# EAGLE design Automaton_no_switches (EAGLE 6.1)
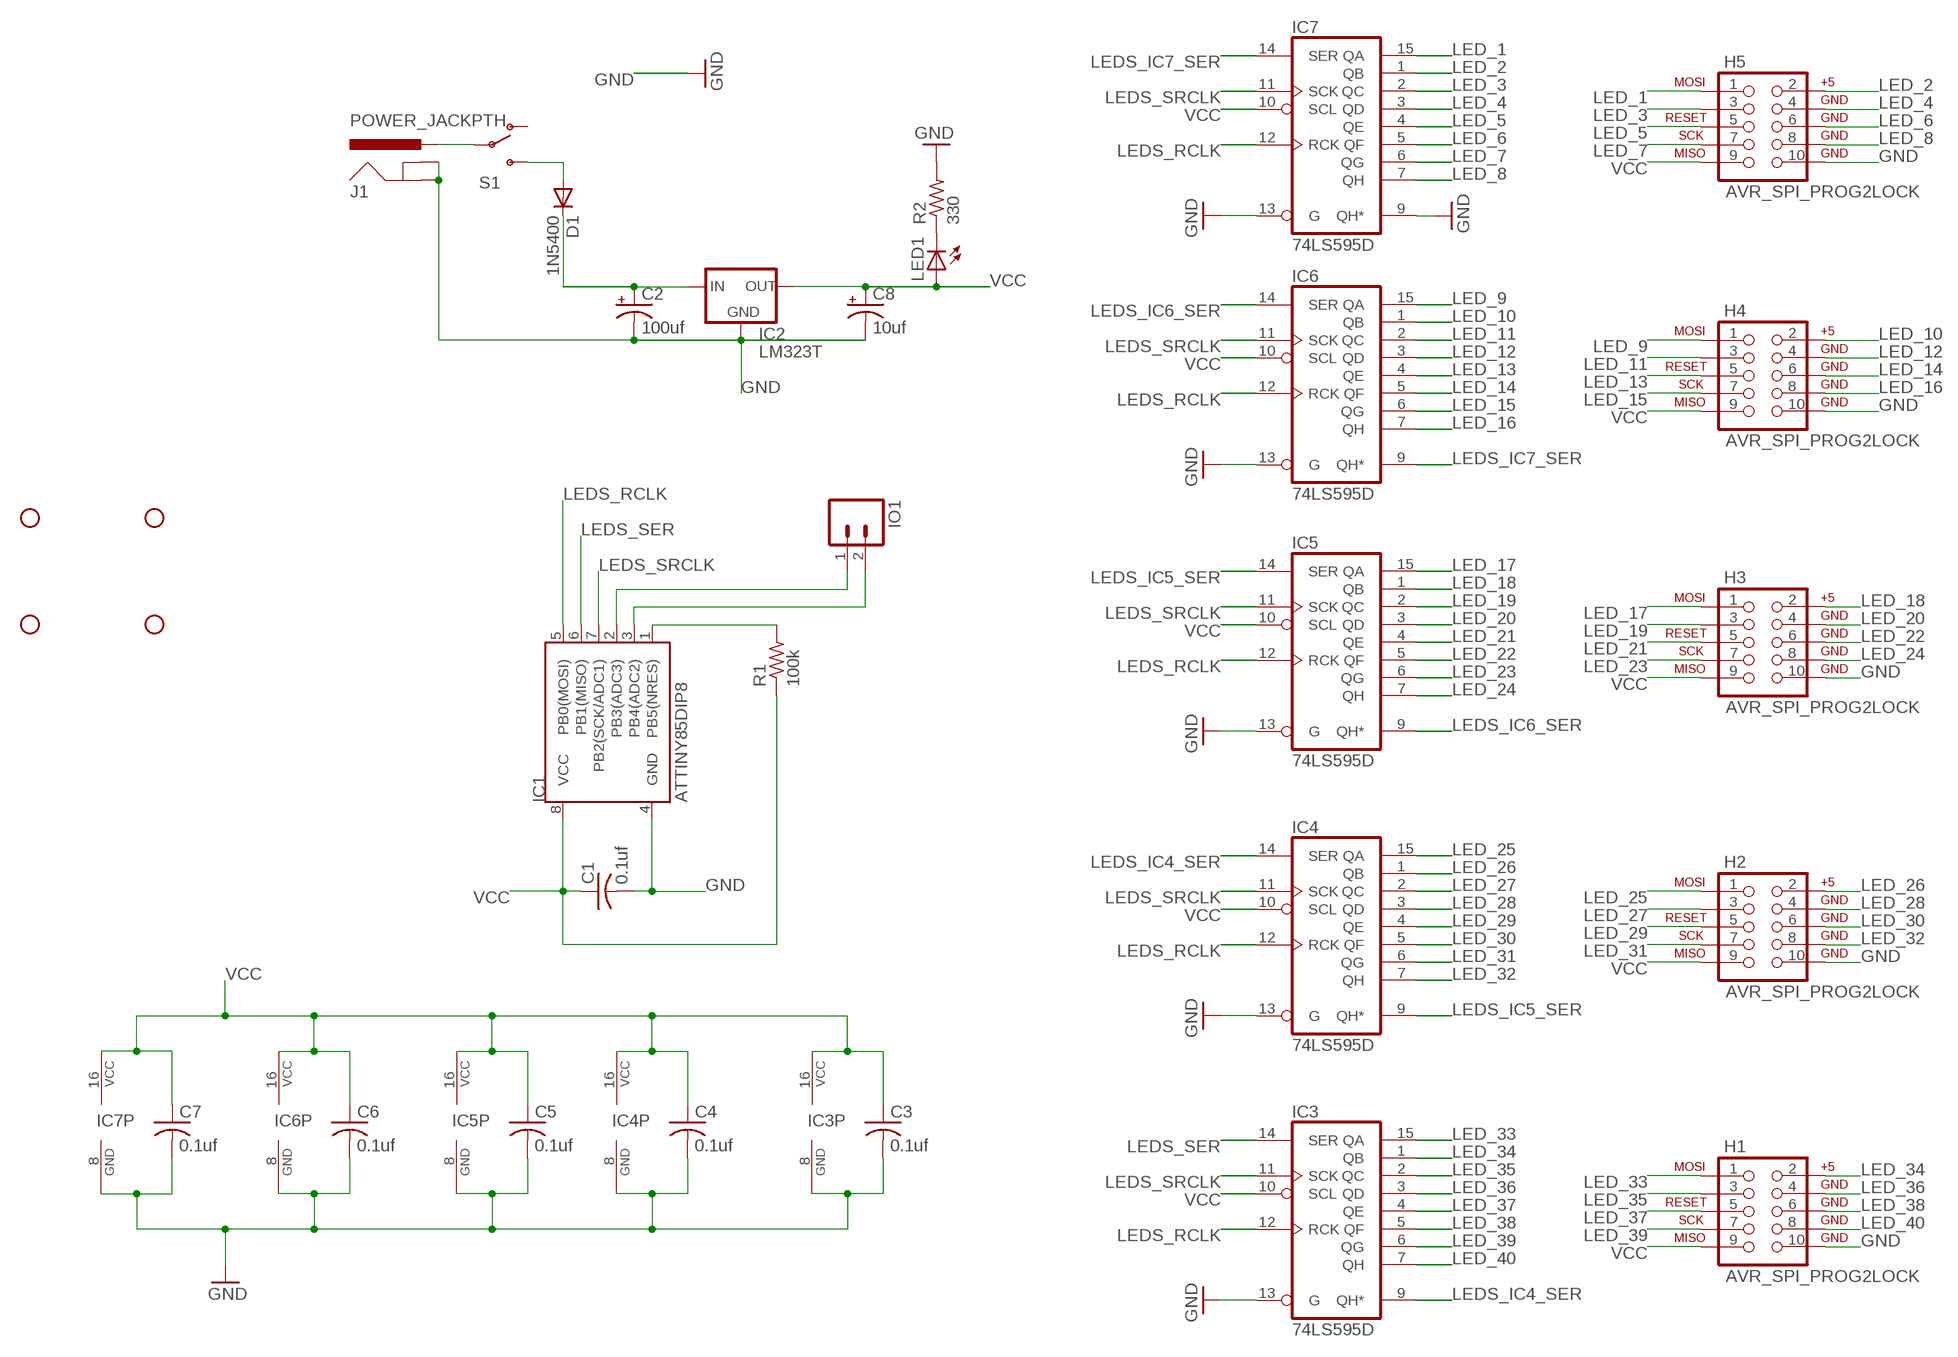
[diagram p0: schematic, sheet 1]

## Parts
C1  0.1uf  C-USC1206  [C1206]
C2  100uf  CPOL-USE5-10.5  [E5-10,5]
C3  0.1uf  C-USC1206  [C1206]
C4  0.1uf  C-USC1206  [C1206]
C5  0.1uf  C-USC1206  [C1206]
C6  0.1uf  C-USC1206  [C1206]
C7  0.1uf  C-USC1206  [C1206]
C8  10uf  CPOL-USE2-5  [E2-5]
D1  1N5400  [DO201-15]
H1  AVR_SPI_PROG2LOCK  [2X5-SHROUDED_LOCK]
H2  AVR_SPI_PROG2LOCK  [2X5-SHROUDED_LOCK]
H3  AVR_SPI_PROG2LOCK  [2X5-SHROUDED_LOCK]
H4  AVR_SPI_PROG2LOCK  [2X5-SHROUDED_LOCK]
H5  AVR_SPI_PROG2LOCK  [2X5-SHROUDED_LOCK]
HOLE1  STAND-OFF  [STAND-OFF]
HOLE2  STAND-OFF  [STAND-OFF]
HOLE3  STAND-OFF  [STAND-OFF]
HOLE4  STAND-OFF  [STAND-OFF]
IC1  ATTINY85DIP8  [DIP08]
IC2  LM323T  V_REG_78XXSINK  [TO220-IGO]
IC3  74LS595D  [SO16]
IC4  74LS595D  [SO16]
IC5  74LS595D  [SO16]
IC6  74LS595D  [SO16]
IC7  74LS595D  [SO16]
IO1  M02PTH3  [1X02_LONGPADS]
J1  POWER_JACKPTH  [POWER_JACK_PTH]
LED1  LEDSMT1206  [1206]
R1  100k  R-US_M1206  [M1206]
R2  330  R-US_M1206  [M1206]
S1  SWITCH-SPDTPTH_LOCK  [SWITCH-SPDT_LOCK.007S]

## Nets
GND: C1.2 C2.- C3.2 C4.2 C5.2 C6.2 C7.2 C8.- H1.10 H2.10 H3.10 H4.10 H5.10 IC1.4(GND) IC2.GND IC3.8(GND) IC3.13(G) IC4.8(GND) IC4.13(G) IC5.8(GND) IC5.13(G) IC6.8(GND) IC6.13(G) IC7.8(GND) IC7.9(QH*) IC7.13(G) J1.GND J1.GNDBREAK R2.2
LED_1: H5.1 IC7.15(QA)
LED_2: H5.2 IC7.1(QB)
LED_3: H5.3 IC7.2(QC)
LED_4: H5.4 IC7.3(QD)
LED_5: H5.5 IC7.4(QE)
LED_6: H5.6 IC7.5(QF)
LED_7: H5.7 IC7.6(QG)
LED_8: H5.8 IC7.7(QH)
LED_9: H4.1 IC6.15(QA)
LED_10: H4.2 IC6.1(QB)
LED_11: H4.3 IC6.2(QC)
LED_12: H4.4 IC6.3(QD)
LED_13: H4.5 IC6.4(QE)
LED_14: H4.6 IC6.5(QF)
LED_15: H4.7 IC6.6(QG)
LED_16: H4.8 IC6.7(QH)
LED_17: H3.1 IC5.15(QA)
LED_18: H3.2 IC5.1(QB)
LED_19: H3.3 IC5.2(QC)
LED_20: H3.4 IC5.3(QD)
LED_21: H3.5 IC5.4(QE)
LED_22: H3.6 IC5.5(QF)
LED_23: H3.7 IC5.6(QG)
LED_24: H3.8 IC5.7(QH)
LED_25: H2.1 IC4.15(QA)
LED_26: H2.2 IC4.1(QB)
LED_27: H2.3 IC4.2(QC)
LED_28: H2.4 IC4.3(QD)
LED_29: H2.5 IC4.4(QE)
LED_30: H2.6 IC4.5(QF)
LED_31: H2.7 IC4.6(QG)
LED_32: H2.8 IC4.7(QH)
LED_33: H1.1 IC3.15(QA)
LED_34: H1.2 IC3.1(QB)
LED_35: H1.3 IC3.2(QC)
LED_36: H1.4 IC3.3(QD)
LED_37: H1.5 IC3.4(QE)
LED_38: H1.6 IC3.5(QF)
LED_39: H1.7 IC3.6(QG)
LED_40: H1.8 IC3.7(QH)
LEDS_IC4_SER: IC3.9(QH*) IC4.14(SER)
LEDS_IC5_SER: IC4.9(QH*) IC5.14(SER)
LEDS_IC6_SER: IC5.9(QH*) IC6.14(SER)
LEDS_IC7_SER: IC6.9(QH*) IC7.14(SER)
LEDS_RCLK: IC1.5(PB0(MOSI)) IC3.12(RCK) IC4.12(RCK) IC5.12(RCK) IC6.12(RCK) IC7.12(RCK)
LEDS_SER: IC1.6(PB1(MISO)) IC3.14(SER)
LEDS_SRCLK: IC1.7(PB2(SCK/ADC1)) IC3.11(SCK) IC4.11(SCK) IC5.11(SCK) IC6.11(SCK) IC7.11(SCK)
N$1: C2.+ D1.C IC2.IN
N$2: IC1.1(PB5(NRES)) R1.2
N$3: J1.PWR S1.2(P)
N$4: D1.A S1.3(S)
N$5: LED1.C R2.1
PB3: IC1.2(PB3(ADC3)) IO1.1
PB4: IC1.3(PB4(ADC2)) IO1.2
VCC: C1.1 C3.1 C4.1 C5.1 C6.1 C7.1 C8.+ H1.9 H2.9 H3.9 H4.9 H5.9 IC1.8(VCC) IC2.OUT IC3.10(SCL) IC3.16(VCC) IC4.10(SCL) IC4.16(VCC) IC5.10(SCL) IC5.16(VCC) IC6.10(SCL) IC6.16(VCC) IC7.10(SCL) IC7.16(VCC) LED1.A R1.1
Unconnected: S1.1(O)

## Library data of the parts
C1 C3-C7 = resistor:C-US: CAPACITOR, American symbol
C2 C8 = rcl:CPOL-US: POLARIZED CAPACITOR, American symbol
D1 = diode:1N5400: DIODE standard rectifier, 3 A, 50 V (Motorola)
H1-H5 = SparkFun:AVR_SPI_PROG2: AVR ICSP Header This is the standard AVR In Circuit Serial Programming header. Minimal, but includes pin one indicator. Works with standard Olimex programmers. Also look for the 6-pin reduced version. Spark Fun Electronics SKU: PRT-00778
HOLE1-HOLE4 = SparkFun-Electromechanical:STAND-OFF: #4 Stand Off This is the mechanical footprint for a #4 phillips button head screw. Use the keepout ring to avoid running the screw head into surrounding components. SKU : PRT-00447
IC1 = *Personal Library:ATTINY85: Atmel 8-pin 2/4/8kB flash uC
IC2 = SparkFun-PowerIC:V_REG_78XX: Voltage Regulator Standard 7805 5V regulator. IGO (Input Ground Output). Spark Fun Electronics SKU : COM-00107
IC3-IC7 = 74xx-us:74*595: 8-bit SHIFT REGISTER, output latch
IO1 = SparkFun-Connectors:M02: Header 2 Standard 2-pin 0.1" header. Use with straight break away headers (SKU : PRT-00116), right angle break away headers (PRT-00553), swiss pins (PRT-00743), machine pins (PRT-00117), and female headers (PRT-00115). Molex polarized connector foot print use with SKU : PRT-08233 with associated crimp pins and housings.
J1 = SparkFun:POWER_JACK: Power Jack This is the standard 5.5mm barrel jack for power. The PTH is the most common, proven, reliable, footprint. All others are experimental. The Slot footprint only works if the mill layer is transmitted to the PCB fab house so be warned. Spark Fun Electronics SKU : PRT-00119. Mating wall wart : TOL-00298 (and others)
LED1 = led:LED: LED OSRAM: - CHIPLED LG R971, LG N971, LY N971, LG Q971, LY Q971, LO R971, LY R971 LH N974, LH R974 LS Q976, LO Q976, LY Q976 LO Q996 - Hyper CHIPLED LW Q18S LB Q993, LB Q99A, LB R99A - SideLED LS A670, LO A670, LY A670, LG A670, LP A670 LB A673, LV A673, LT A673, LW A673 LH A674 LY A675 LS A676, LA A676, LO A676, LY A676, LW A676 LS A679, LY A679, LG A679 - Hyper Micro SIDELED® LS Y876, LA Y876, LO Y876, LY Y876 LT Y87S - SmartLED LW L88C, LW L88S LB L89C, LB L89S, LG L890 LS L89K, LO L89K, LY L89K LS L896, LA L896, LO L896, LY L896 - TOPLED LS T670, LO T670, LY T670, LG T670, LP T670 LSG T670, LSP T670, LSY T670, LOP T670, LYG T670 LG T671, LOG T671, LSG T671 LB T673, LV T673, LT T673, LW T673 LH T674 LS T676, LA T676, LO T676, LY T676, LB T676, LH T676, LSB T676, LW T676 LB T67C, LV T67C, LT T67C, LS T67K, LO T67K, LY T67K, LW E67C LS E67B, LA E67B, LO E67B, LY E67B, LB E67C, LV E67C, LT E67C LW T67C LS T679, LY T679, LG T679 LS T770, LO T770, LY T770, LG T770, LP T770 LB T773, LV T773, LT T773, LW T773 LH T774 LS E675, LA E675, LY E675, LS T675 LS T776, LA T776, LO T776, LY T776, LB T776 LHGB T686 LT T68C, LB T68C - Hyper Mini TOPLED® LB M676 - Mini TOPLED Santana® LG M470 LS M47K, LO M47K, LY M47K Source: http://www.osram.convergy.de LUXEON: - LUMILED® LXK2-PW12-R00, LXK2-PW12-S00, LXK2-PW14-U00, LXK2-PW14-V00 LXK2-PM12-R00, LXK2-PM12-S00, LXK2-PM14-U00 LXK2-PE12-Q00, LXK2-PE12-R00, LXK2-PE12-S00, LXK2-PE14-T00, LXK2-PE14-U00 LXK2-PB12-K00, LXK2-PB12-L00, LXK2-PB12-M00, LXK2-PB14-N00, LXK2-PB14-P00, LXK2-PB14-Q00 LXK2-PR12-L00, LXK2-PR12-M00, LXK2-PR14-Q00, LXK2-PR14-R00 LXK2-PD12-Q00, LXK2-PD12-R00, LXK2-PD12-S00 LXK2-PH12-R00, LXK2-PH12-S00 LXK2-PL12-P00, LXK2-PL12-Q00, LXK2-PL12-R00 Source: www.luxeon.com KINGBRIGHT: KA-3528ASYC Source: www.kingbright.com
R1 R2 = resistor:R-US_: RESISTOR, American symbol
S1 = SparkFun-Electromechanical:SWITCH-SPDT: SPST Switch Simple slide switch. Spark Fun Electronics SKU : COM-00102

## Board
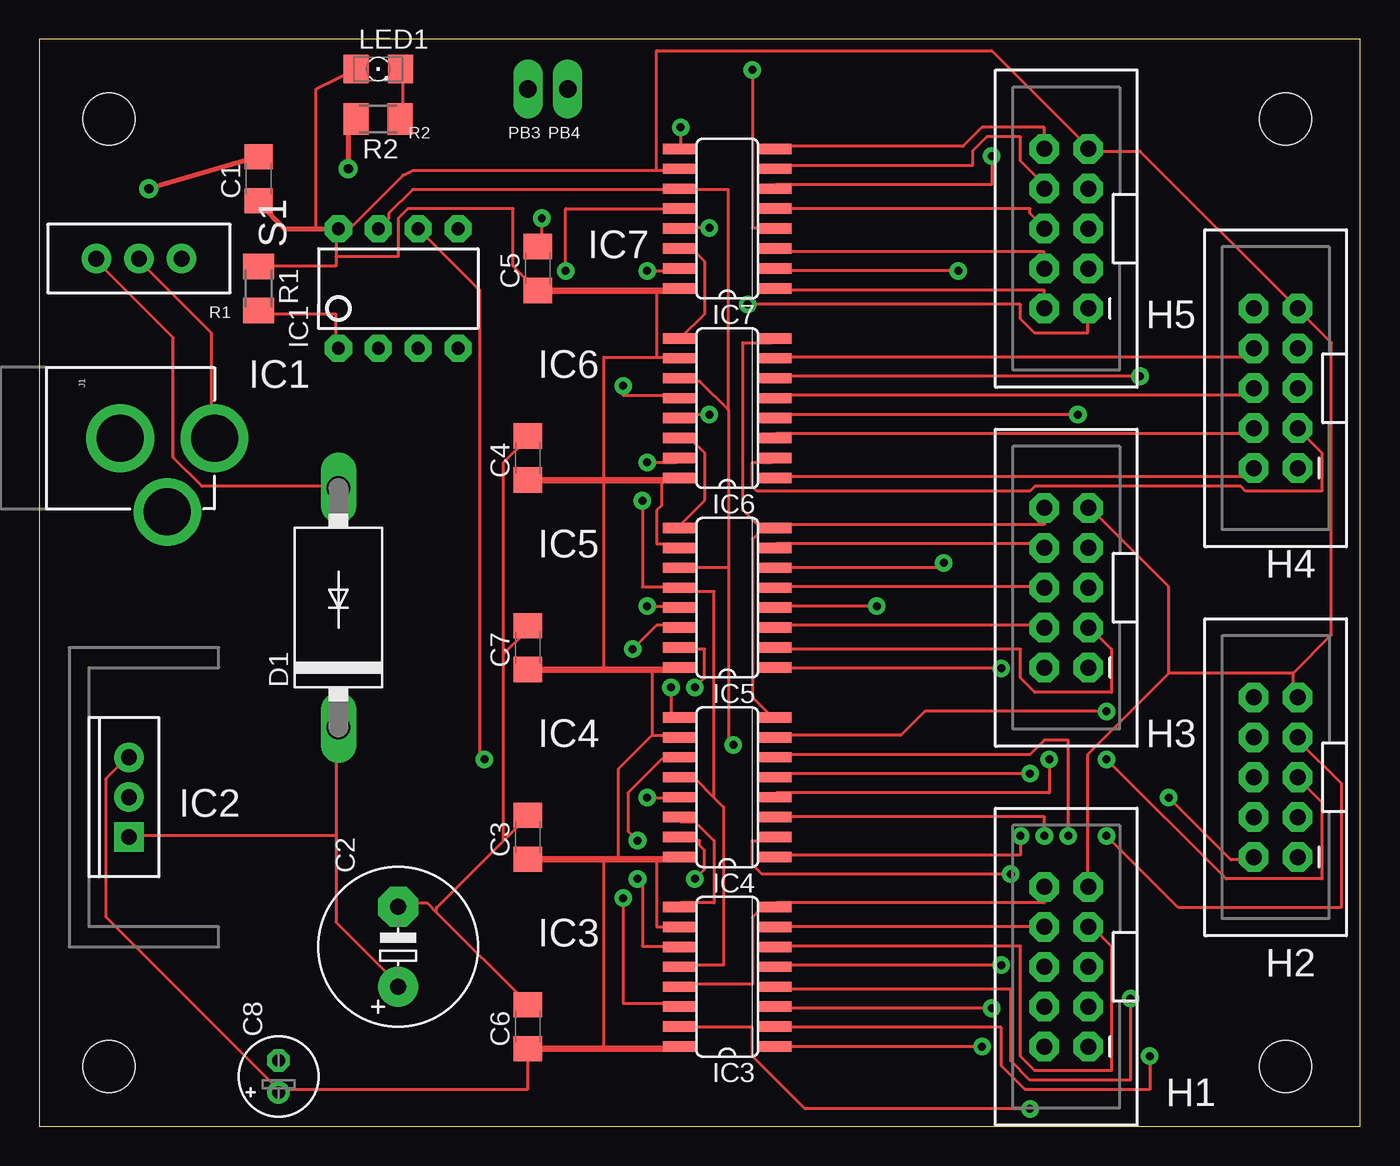
[diagram p1: board, top side]
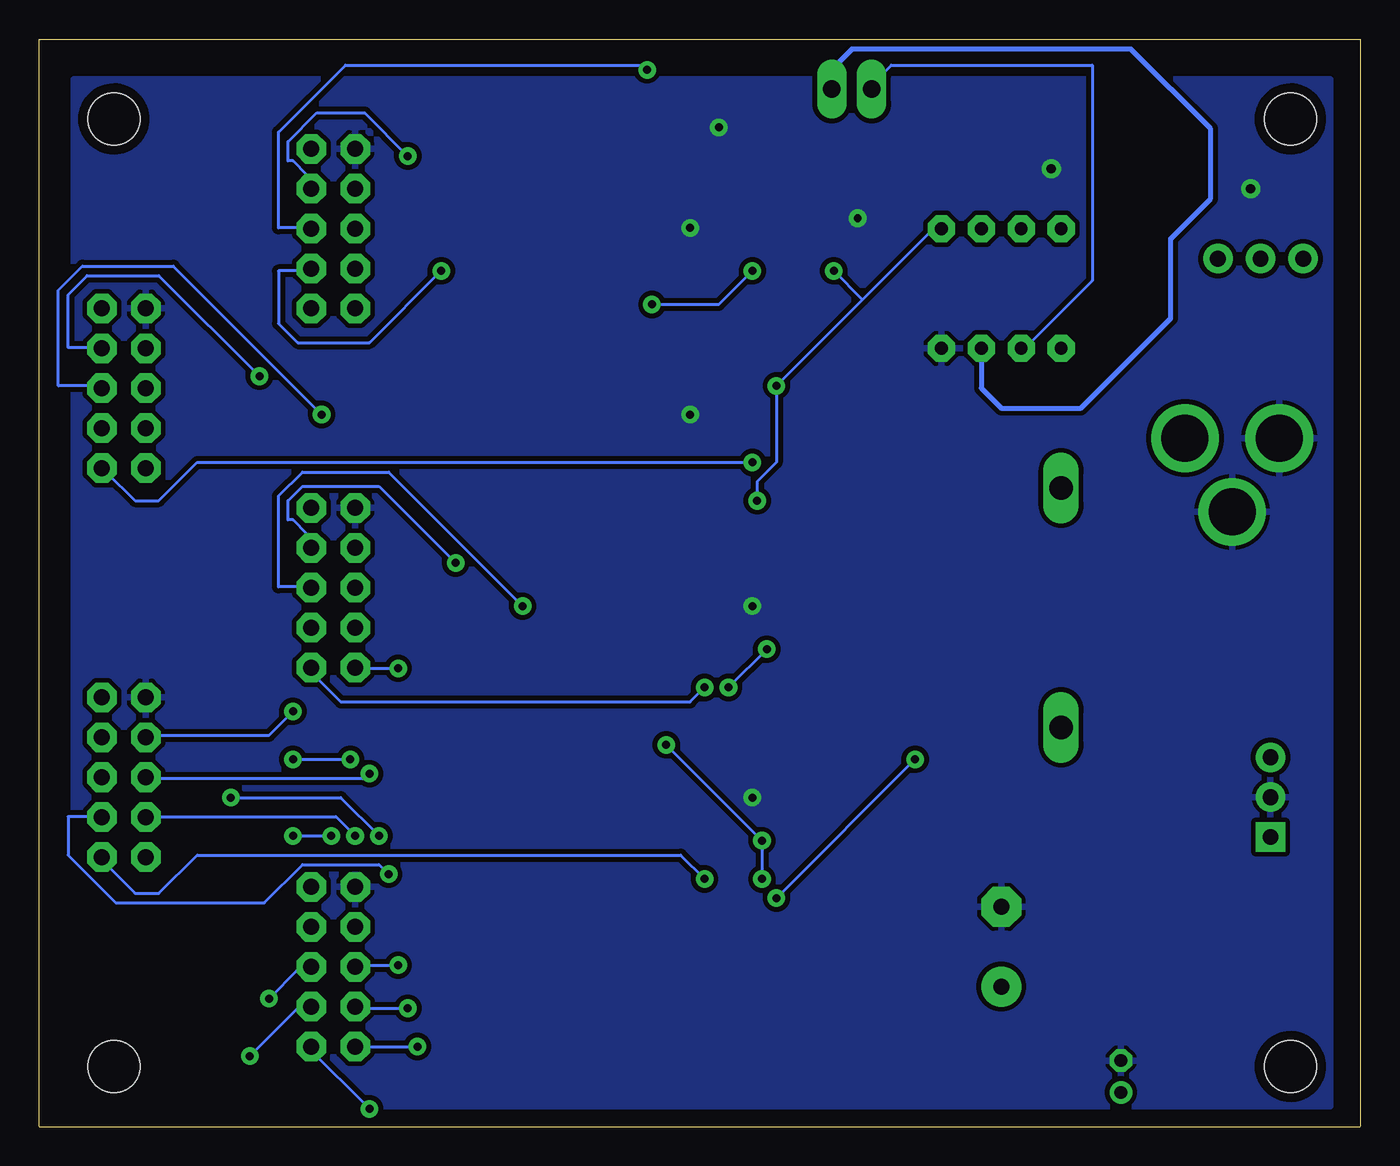
[diagram p2: board, bottom side, seen from below]

Size 84.12 x 69.22 mm. Coordinates in mm from the lower left corner, seen from the top.
Outline: 84.12,0.01 84.12,69.22 0,69.22 0,0.01
Outline: 84.12,0 0,0
Copper layers (1*16): Top 0.035mm / dielectric 1.5mm / Bottom 0.035mm
Design rules: minimum track width 8mil, minimum drill 20mil, track to track 12mil, track to pad 12mil, pad to pad 12mil, via to via 12mil, smd to smd 10mil, copper to edge 12mil, drill to drill 12mil, minimum pad ring 12mil, minimum via ring 12mil, stop-mask expansion 4mil, vias tented up to drill 25mil, thermal gap 10mil

### Footprints (pad centres in the part's own frame; a part is rotated, then mirrored left to right if it is on the bottom)
C1206 = smd 1.6 x 1.8: 1 -1.4,0; 2 1.4,0
E5-10,5 = drill 1.016 pad 2.54: + -2.54,0 | drill 1.016 pad 2.54 octagon: - 2.54,0
E2-5 = drill 0.813 pad 1.27: + -1.016,0 | drill 0.813 pad 1.27 octagon: - 1.016,0
DO201-15 = drill 1.499 long: A 7.62,0; C -7.62,0
2X5-SHROUDED_LOCK = drill 1.016 pad 1.88 octagon: 1 -1.397,5.08; 2 1.397,5.08; 3 -1.397,2.54; 4 1.397,2.54; 5 -1.397,0; 6 1.397,0; 7 -1.397,-2.54; 8 1.397,-2.54; 9 -1.397,-5.08; 10 1.397,-5.08
STAND-OFF = hole 3.302: 0,0
DIP08 = drill 0.813 pad 1.727 octagon: 1 -3.81,-3.81; 2 -1.27,-3.81; 3 1.27,-3.81; 4 3.81,-3.81; 5 3.81,3.81; 6 1.27,3.81; 7 -1.27,3.81; 8 -3.81,3.81
TO220-IGO = drill 1 pad 1.88: GND 0,0; OUT 2.54,0 | drill 1 pad 1.88 square: IN -2.54,0
SO16 = smd 0.66 x 2.032: 1 -4.445,-3.073; 2 -3.175,-3.073; 3 -1.905,-3.073; 4 -0.635,-3.073; 5 0.635,-3.073; 6 1.905,-3.073; 7 3.175,-3.073; 8 4.445,-3.073; 9 4.445,3.073; 10 3.175,3.073; 11 1.905,3.073; 12 0.635,3.073; 13 -0.635,3.073; 14 -1.905,3.073; 15 -3.175,3.073; 16 -4.445,3.073
1X02_LONGPADS = drill 1.118 pad 1.88 long: 1 0,0; 2 2.54,0
POWER_JACK_PTH = drill 2.997 pad 4.318: GND 0,7.7; GNDBREAK 4.7,10.7; PWR 0,13.7
1206 = smd 1.6 x 1.803: A -1.422,0; C 1.422,0
M1206 = smd 1.6 x 2: 1 -1.4,0; 2 1.4,0
SWITCH-SPDT_LOCK.007S = drill 1.016 pad 1.88: 1 0,2.718; 2 0,0; 3 0,-2.718

### Placement (x,y rotation side)
C1  13.97,60.34 90 top
C2  22.86,11.44 90 top
C3  31.11,18.42 90 top
C4  31.11,42.55 90 top
C5  31.75,54.62 90 top
C6  31.11,6.36 90 top
C7  31.11,30.49 90 top
C8  15.24,3.19 90 top
D1  19.05,33.03 90 top
H1  65.41,10.17 180 top
H2  78.74,22.23 180 top
H3  65.41,34.3 180 top
H4  78.74,47 180 top
H5  65.41,57.16 180 top
HOLE1  4.45,64.14 0 top
HOLE2  79.38,64.14 0 top
HOLE3  79.38,3.82 0 top
HOLE4  4.45,3.82 0 top
IC1  22.86,53.35 0 top
IC2  5.71,20.96 90 top
IC3  43.81,9.54 90 top
IC4  43.81,21.6 90 top
IC5  43.81,33.66 90 top
IC6  43.81,45.73 90 top
IC7  43.81,57.8 90 top
IO1  31.11,66.05 0 top
J1  -2.54,43.82 270 top
LED1  21.59,67.32 0 top
R1  13.97,53.35 270 top
R2  21.59,64.14 180 top
S1  6.35,55.25 270 top

### Tracks (layer width: path | path; a pad name or v marks a point on that pad's centre or on a via)
GND  (via drill 0.51, 0.6)
  Top 0.203: 46.02,38.01 45.41,37.4 45.41,27.34 46.63,26.12 IC4.8 | 46.02,38.01 46.63,38.01 IC5.8 | 46.02,38.01 44.81,39.23 44.81,49.9 46.63,49.9 IC6.8 | 46.02,38.01 IC5.8 | IC3.13 40.84,9.05 45.41,9.05 45.41,13.32 46.02,13.93 46.63,13.93 IC3.8 46.94,14.23 64.01,14.23 H1.10 | 25.3,13.62 24.69,14.23 22.86,14.23 C2.- | 25.3,13.62 31.09,7.83 C6.2 | 29.57,18.2 25.3,13.93 25.3,13.62 | 29.57,18.2 31.09,19.72 C3.2 | 29.57,30.08 31.09,31.61 C7.2 | 29.57,18.2 29.57,30.08 | 29.57,30.08 29.57,42.28 31.09,43.8 C4.2 | v32,57.82 32,56.3 C5.2 | v38.71,20.94 40.54,20.94 IC4.13 | v38.71,33.13 40.54,33.13 IC5.13 | v42.67,45.32 40.84,45.32 IC6.13 | v42.67,57.21 40.84,57.21 IC7.13 | H5.10 64.01,63.61 60.05,63.61 58.83,62.39 46.94,62.39 IC7.8 | H3.10 64.01,38.31 46.94,38.31 IC5.8 | v40.84,63.61 40.84,62.39 IC7.9
  Top 0.305: C1.2 v6.99,59.7 | R2.2 19.68,63.64 v19.68,60.97
  pour Bottom (isolate 0.305): 81.92,66.69 1.91,66.69 1.91,1.28 81.92,1.28
LED_1  (via drill 0.51)
  Top 0.203: v38.71,54.47 40.54,54.47 IC7.15 | v45.11,52.33 62.48,52.33 62.48,51.42 63.4,50.5 66.75,50.5 66.75,52.03 H5.1
  Bottom 0.203: v38.71,54.47 40.84,52.33 v45.11,52.33
LED_2
  Top 0.203: H5.2 64.01,53.25 46.94,53.25 IC7.1
LED_3  (via drill 0.51)
  Top 0.203: v58.52,54.47 46.94,54.47 IC7.2
  Bottom 0.203: v58.52,54.47 63.09,49.9 67.67,49.9 68.89,51.12 68.89,54.47 67.06,54.47 H5.3
LED_4
  Top 0.203: H5.4 64.01,55.69 46.94,55.69 IC7.3
LED_5  (via drill 0.51)
  Top 0.203: v45.41,67.27 45.41,57.21 46.63,57.21 IC7.4
  Bottom 0.203: v45.41,67.27 45.72,67.57 64.62,67.57 68.89,63.31 68.89,57.21 67.06,57.21 H5.5
LED_6
  Top 0.203: IC7.5 63.09,58.43 63.09,58.12 64.01,57.21 H5.6
LED_7  (via drill 0.51)
  Top 0.203: v60.66,61.78 60.66,59.95 46.94,59.95 IC7.6
  Bottom 0.203: v60.66,61.78 63.4,64.53 66.45,64.53 68.28,62.7 68.28,61.48 67.97,61.48 67.06,60.56 67.06,59.95 H5.7
LED_8
  Top 0.203: IC7.7 46.94,61.17 59.44,61.17 59.44,62.09 60.35,63 62.48,63 62.48,61.48 64.01,59.95 H5.8
LED_9  (via drill 0.51)
  Top 0.203: v38.71,42.28 40.54,42.28 IC6.15
  Bottom 0.203: v38.71,42.28 74.07,42.28 76.5,39.84 78.03,39.84 79.86,41.67 H4.1
LED_10
  Top 0.203: IC6.1 46.94,41.36 77.11,41.36 77.11,41.67 H4.2
LED_11
  Top 0.203: IC6.2 46.63,42.28 45.41,42.28 45.41,40.75 45.72,40.45 63.09,40.45 63.4,40.75 76.5,40.75 76.81,40.45 81.69,40.45 81.69,42.88 80.16,44.41 H4.3
LED_12
  Top 0.203: IC6.3 46.94,44.1 77.11,44.1 77.11,44.41 H4.4
LED_13  (via drill 0.51)
  Top 0.203: v66.14,45.32 46.94,45.32 IC6.4
  Bottom 0.203: v66.14,45.32 75.59,54.77 81.38,54.77 82.91,53.25 82.91,47.15 80.16,47.15 H4.5
LED_14
  Top 0.203: IC6.5 46.94,46.54 77.11,46.54 77.11,46.85 H4.6
LED_15  (via drill 0.51)
  Top 0.203: v70.1,47.76 46.94,47.76 IC6.6
  Bottom 0.203: v70.1,47.76 76.5,54.16 81.08,54.16 82.3,52.94 82.3,49.59 80.16,49.59 H4.7
LED_16
  Top 0.203: IC6.7 46.94,48.98 77.11,48.98 77.11,49.29 H4.8
LED_17  (via drill 0.51)
  Top 0.203: v41.76,27.95 42.37,28.56 42.37,30.39 40.84,30.39 IC5.15
  Bottom 0.203: v41.76,27.95 42.67,27.04 64.92,27.04 67.06,29.17 H3.1
LED_18  (via drill 0.51)
  Top 0.203: v61.27,29.17 46.94,29.17 IC5.1
  Bottom 0.203: v61.27,29.17 64.01,29.17 H3.2
LED_19
  Top 0.203: IC5.2 46.94,30.39 62.48,30.39 62.48,28.56 63.4,27.64 68.28,27.64 68.28,30.39 67.06,31.61 H3.3
LED_20
  Top 0.203: IC5.3 46.94,31.91 64.01,31.91 H3.4
LED_21  (via drill 0.51)
  Top 0.203: v53.34,33.13 46.94,33.13 IC5.4
  Bottom 0.203: v53.34,33.13 61.87,41.67 67.36,41.67 68.89,40.14 68.89,34.35 67.06,34.35 H3.5
LED_22
  Top 0.203: IC5.5 46.94,34.35 64.01,34.35 H3.6
LED_23  (via drill 0.51)
  Top 0.203: IC5.6 57.61,35.57 v57.61,35.88
  Bottom 0.203: v57.61,35.88 62.48,40.75 67.36,40.75 68.28,39.84 68.28,38.62 67.97,38.62 67.06,37.7 67.06,37.09 H3.7
LED_24
  Top 0.203: IC5.7 46.94,37.09 64.01,37.09 H3.8
LED_25  (via drill 0.51)
  Top 0.203: v41.76,15.76 42.37,16.37 42.37,17.59 42.06,17.89 42.06,18.2 40.84,18.2 IC4.15
  Bottom 0.203: v41.76,15.76 43.28,17.28 74.07,17.28 76.5,14.84 78.03,14.84 80.16,16.98 H2.1
LED_26  (via drill 0.51)
  Top 0.203: v62.48,18.5 62.48,17.28 46.94,17.28 IC4.1 | v71.93,20.94 75.89,16.98 77.11,16.98 H2.2
  Bottom 0.203: v62.48,18.5 64.92,20.94 v71.93,20.94
LED_27  (via drill 0.51)
  Top 0.203: v61.87,16.06 46.02,16.06 45.41,16.67 45.41,18.2 46.63,18.2 IC4.2
  Bottom 0.203: v61.87,16.06 62.48,16.67 67.36,16.67 69.8,14.23 79.25,14.23 82.3,17.28 82.3,19.72 80.16,19.72 H2.3
LED_28  (via drill 0.51)
  Top 0.203: v64.01,18.5 64.01,19.72 46.94,19.72 IC4.3
  Bottom 0.203: v64.01,18.5 65.23,19.72 77.11,19.72 H2.4
LED_29  (via drill 0.51)
  Top 0.203: v64.31,23.38 64.31,21.24 46.94,21.24 IC4.4 | v67.97,23.38 75.59,15.76 81.69,15.76 81.69,20.63 80.16,22.16 H2.5
  Bottom 0.203: v67.97,23.38 v64.31,23.38
LED_30  (via drill 0.51)
  Top 0.203: v63.09,22.46 46.94,22.46 IC4.5
  Bottom 0.203: v63.09,22.46 63.4,22.16 77.11,22.16 H2.6
LED_31  (via drill 0.51)
  Top 0.203: v65.53,18.5 65.53,24.6 64.01,24.6 63.09,23.68 46.94,23.68 IC4.6 | v67.97,18.5 72.54,13.93 82.91,13.93 82.91,21.85 80.16,24.6 H2.7
  Bottom 0.203: v67.97,18.5 v65.53,18.5
LED_32  (via drill 0.51)
  Top 0.203: v67.97,26.43 56.39,26.43 54.86,24.9 46.94,24.9 IC4.7
  Bottom 0.203: v67.97,26.43 69.49,24.9 77.11,24.9 H2.8
LED_33  (via drill 0.51)
  Top 0.203: v63.09,1.13 48.77,1.13 45.41,4.48 45.41,6.31 40.84,6.31 IC3.15
  Bottom 0.203: v63.09,1.13 67.06,5.09 H1.1
LED_34  (via drill 0.51)
  Top 0.203: v60.05,5.09 IC3.1
  Bottom 0.203: H1.2 v60.05,5.09
LED_35  (via drill 0.51)
  Top 0.203: v70.71,4.48 70.71,2.35 62.79,2.35 61.27,3.87 61.27,6.31 46.94,6.31 IC3.2
  Bottom 0.203: v70.71,4.48 67.67,7.53 67.06,7.53 H1.3
LED_36  (via drill 0.51)
  Top 0.203: v60.66,7.53 46.94,7.53 IC3.3
  Bottom 0.203: v60.66,7.53 64.01,7.53 H1.4
LED_37  (via drill 0.51)
  Top 0.203: v69.49,8.14 69.49,2.96 63.09,2.96 61.87,4.18 61.87,8.75 46.94,8.75 IC3.4
  Bottom 0.203: v69.49,8.14 67.67,9.97 67.06,9.97 H1.5
LED_38  (via drill 0.51)
  Top 0.203: v61.27,10.27 46.94,10.27 IC3.5
  Bottom 0.203: v61.27,10.27 64.01,10.27 H1.6
LED_39
  Top 0.203: IC3.6 46.94,11.49 62.48,11.49 62.48,4.48 63.4,3.57 68.28,3.57 68.28,11.49 67.06,12.71 H1.7
LED_40
  Top 0.203: H1.8 IC3.7
LEDS_IC4_SER
  Top 0.203: IC3.9 40.84,14.23 42.98,14.23 42.98,18.2 41.76,19.42 40.84,19.42 IC4.14
LEDS_IC5_SER  (via drill 0.51)
  Top 0.203: v40.23,27.95 40.23,26.43 40.54,26.12 IC4.9 | v37.8,30.39 39.32,31.91 40.54,31.91 IC5.14
  Bottom 0.203: v37.8,30.39 v40.23,27.95
LEDS_IC6_SER
  Top 0.203: IC5.9 40.84,38.31 42.37,39.84 42.37,42.88 41.45,43.8 40.84,43.8 IC6.14
LEDS_IC7_SER
  Top 0.203: IC6.9 40.84,50.2 42.37,51.72 42.37,55.08 41.76,55.69 40.84,55.69 IC7.14
LEDS_RCLK  (via drill 0.51)
  Top 0.203: 42.98,20.94 41.76,22.16 40.84,22.16 IC4.12 | 42.98,20.94 43.59,20.33 43.59,10.27 40.84,10.27 IC3.12 | 42.98,20.94 42.98,34.05 40.84,34.05 IC5.12 40.54,34.35 38.41,34.35 v38.41,39.84 | v37.19,47.15 37.19,46.54 40.54,46.54 IC6.12 | IC7.12 33.53,58.43 v33.53,54.47
  Bottom 0.203: 31.7,52.64 27.43,56.91 26.82,56.91 IC1.5 | 31.7,52.64 v37.19,47.15 37.19,42.28 38.41,41.06 v38.41,39.84 | 31.7,52.64 v33.53,54.47
LEDS_SER  (via drill 0.51)
  Top 0.203: v37.19,14.54 37.19,7.83 40.54,7.83 IC3.14 | v28.35,23.38 28.04,23.68 28.04,53.25 IC1.6
  Bottom 0.203: v28.35,23.38 v37.19,14.54
LEDS_SRCLK  (via drill 0.51)
  Top 0.203: v38.1,15.76 38.41,15.45 38.41,11.49 40.54,11.49 IC3.11 | v38.1,18.2 37.49,18.81 37.49,21.24 39.62,23.38 40.54,23.38 IC4.11 | 43.89,35.57 IC5.11 | 43.89,45.63 43.89,35.57 | 43.89,45.63 42.06,47.46 40.84,47.46 IC6.11 | 43.89,45.63 43.89,59.65 40.84,59.65 IC7.11 40.54,59.65 23.77,59.65 22.25,58.12 22.25,57.82 IC1.7 | v44.2,24.29 43.89,24.6 43.89,35.57
  Bottom 0.203: v38.1,15.76 v38.1,18.2 v44.2,24.29
N$1
  Top 0.203: 18.9,18.5 5.79,18.5 IC2.IN | 18.9,18.5 18.9,25.21 D1.C | 18.9,18.5 18.9,13.02 22.86,9.05 C2.+
N$2
  Top 0.203: R1.2 14.02,51.72 18.9,51.72 18.9,49.59 IC1.1
N$3
  Top 0.203: S1.2 6.4,55.08 10.97,50.5 10.97,44.1 J1.PWR
N$4
  Top 0.203: S1.3 3.66,55.08 8.53,50.2 8.53,42.58 10.36,40.75 18.9,40.75 D1.A
N$5
  Top 0.203: LED1.C 23.16,67.27 23.16,64.22 R2.1
PB3
  Bottom 0.203: IC1.2 21.34,49.59 17.07,53.86 17.07,67.57 29.87,67.57 31.39,66.05 IO1.1
PB4
  Bottom 0.305: IC1.3 24.13,47 22.86,45.73 17.78,45.73 12.06,51.45 12.06,56.52 9.53,59.06 9.53,63.51 14.61,68.59 32.38,68.59 33.66,67.32 IO1.2
VCC
  Top 0.203: 71.93,28.86 66.75,23.68 66.75,15.45 H1.9 | 79.86,28.86 71.93,28.86 | 79.86,28.86 79.86,27.34 H2.9 | 71.93,28.86 71.93,34.35 67.06,39.23 H3.9 | 79.86,28.86 82.3,31.3 82.3,49.9 80.16,52.03 H4.9 79.86,52.33 70.1,62.09 67.06,62.09 H5.9 66.75,62.39 60.66,68.49 39.32,68.49 39.32,60.87 | 18.9,56.3 18.9,56.91 IC1.8 17.63,57.21 17.63,66.05 20.12,67.27 LED1.A | 18.9,56.3 18.9,55.38 | 18.9,55.38 18.9,54.77 14.02,54.77 R1.1 | 39.32,60.87 23.8,60.87 23.16,60.56 18.9,56.3 | 39.32,60.87 40.54,60.87 IC7.10 | 39.32,48.98 40.54,48.98 IC6.10 | 39.32,48.98 39.32,53.22 39.32,53.25 | 39.62,41.16 39.62,39.53 39.32,39.23 39.32,37.09 40.54,37.09 IC5.10 | 39.01,24.9 40.54,24.9 IC4.10 | 39.01,24.9 39.01,29.09 39.01,29.17 | 35.97,29.09 35.97,41.16 35.97,48.98 39.32,48.98 | IC3.10 39.32,12.71 39.32,17.02 | 15.24,2.35 31.09,2.35 31.09,4.79 C6.1 | 35.97,4.96 35.97,17.02 | 15.24,2.35 4.27,13.32 4.27,22.16 5.49,23.38 IC2.OUT | 15.24,2.35 C8.+ | 39.01,24.9 36.88,22.77 36.88,17.02 36.88,16.98 | 18.9,55.38 22.86,55.38 22.86,57.82 23.47,58.43 30.18,58.43 30.18,54.77 31.7,53.25 C5.1 | 14.02,58.73 C1.1
  Top 0.305: 14.02,58.73 15.6,57.16 IC1.8
  Top 0.406: C4.1 35.97,41.16 39.62,41.16 40.74,41.16 IC6.16 | C5.1 39.32,53.22 40.74,53.22 IC7.16 | C7.1 35.97,29.09 39.01,29.09 40.74,29.09 IC5.16 | C3.1 35.97,17.02 36.88,17.02 39.32,17.02 40.74,17.02 IC4.16 | C6.1 35.97,4.96 40.74,4.96 IC3.16

### Text on the board
tPlace: R2 | PB3 | PB4 | IC7 | R1 | H5 | IC1 | IC6 | IC5 | H4 | IC4 | H3 | IC2 | IC3 | H2 | H1